# Altium schematic sheet Connector-side-1.SchDoc: =ProjectDescription
size 297 x 209 mm; Address1: Address1; Address2: Address2; Address3: Address3; Address4: Address4; SheetNumber: 5; SheetTotal: 7; Scale: 1:1; DocumentType: Схема электрическая принципиальная
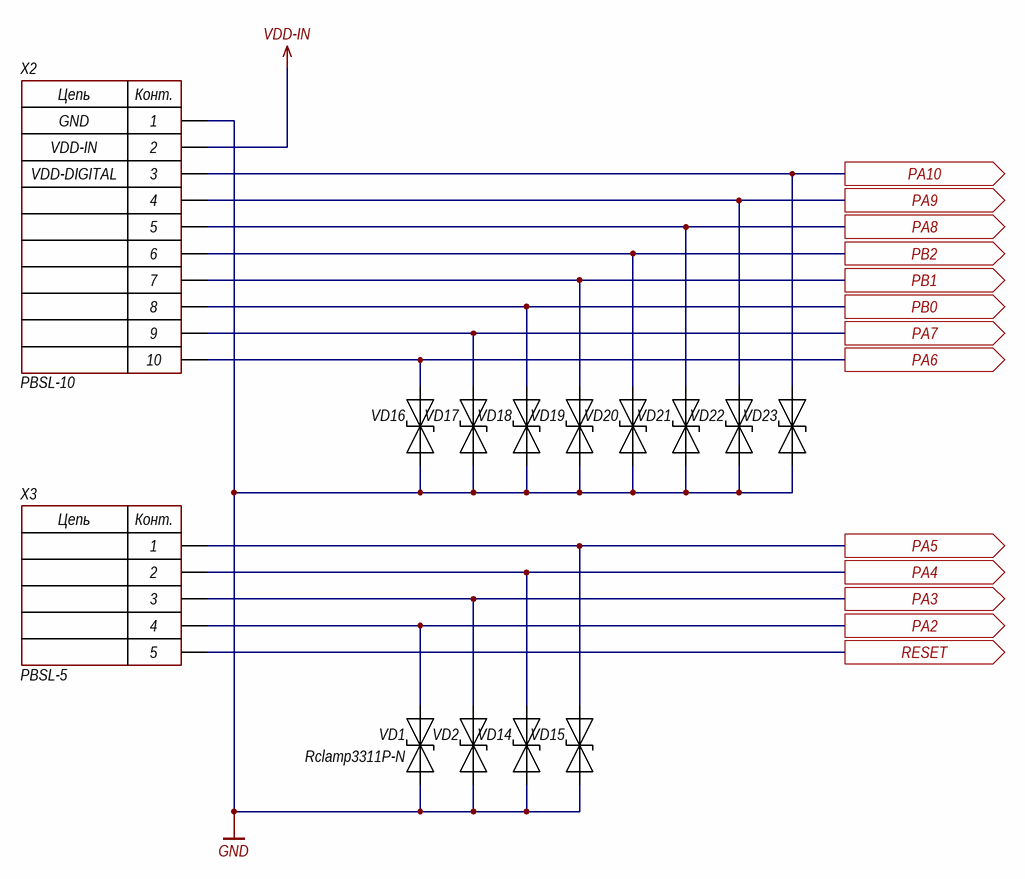
[diagram p0: Connector-side-1.SchDoc]

## Parts
VD1  Rclamp3311P-N  [DFN1006-2]
VD2  Rclamp3311P-N  [DFN1006-2]  (value not drawn)
VD14  Rclamp3311P-N  [DFN1006-2]  (value not drawn)
VD15  Rclamp3311P-N  [DFN1006-2]  (value not drawn)
VD16  Rclamp3311P-N  [DFN1006-2]  (value not drawn)
VD17  Rclamp3311P-N  [DFN1006-2]  (value not drawn)
VD18  Rclamp3311P-N  [DFN1006-2]  (value not drawn)
VD19  Rclamp3311P-N  [DFN1006-2]  (value not drawn)
VD20  Rclamp3311P-N  [DFN1006-2]  (value not drawn)
VD21  Rclamp3311P-N  [DFN1006-2]  (value not drawn)
VD22  Rclamp3311P-N  [DFN1006-2]  (value not drawn)
VD23  Rclamp3311P-N  [DFN1006-2]  (value not drawn)
X2  PBSL-10  [CON: PBSL-10]
X3  PBSL-5  [CON: PBSL-5]

## Ports
PA2 (out), PA3 (out), PA4 (out), PA5 (out), PA6 (out), PA7 (out), PA8 (out), PA9 (out), PA10 (out), PB0 (out), PB1 (out), PB2 (out), RESET (out)

## Nets
GND: VD1.1(A) VD2.1(A) VD14.1(A) VD15.1(A) VD16.1(A) VD17.1(A) VD18.1(A) VD19.1(A) VD20.1(A) VD21.1(A) VD22.1(A) VD23.1(A) X2.1
VDD-IN: X2.2
PA2: VD1.2(C) X3.4 ; port PA2
PA3: VD2.2(C) X3.3 ; port PA3
PA4: VD14.2(C) X3.2 ; port PA4
PA5: VD15.2(C) X3.1 ; port PA5
PA6: VD16.2(C) X2.10 ; port PA6
PA7: VD17.2(C) X2.9 ; port PA7
PA8: VD21.2(C) X2.5 ; port PA8
PA9: VD22.2(C) X2.4 ; port PA9
PA10: VD23.2(C) X2.3 ; port PA10
PB0: VD18.2(C) X2.8 ; port PB0
PB1: VD19.2(C) X2.7 ; port PB1
PB2: VD20.2(C) X2.6 ; port PB2
RESET: X3.5 ; port RESET

## Notes on the sheet
- GND
- VDD-IN
- VDD-DIGITAL
- Изм.
- Лист
- № докум.
- Подп.
- Дата
- Копировал
- Формат А4
- (in symbol 5-Connector) Цепь; Конт.
- (in symbol 10-Connector) Цепь; Конт.

## Library data of the parts
VD1 VD2 VD14-VD23 = TVS-diod: Manufacturer: BORN; ComponentKind: 3.3V, 8V. 10A; Model: Rclamp3311P-N; HelpURL: https://www.lcsc.com/product-detail/ESD-Protection-Devices_BORN-Rclamp3311P-N_C406234.html
X2 = 10-Connector: Model: PBSL-10; Manufacturer: *; HelpURL: *; ComponentKind: *
X3 = 5-Connector: Model: PBSL-5; Manufacturer: *; HelpURL: *; ComponentKind: *